# EasyEDA Pro project ProDocument_PCB2.epro

# Schematic Schematic2
Create Date: 2023-10-05; Page Name: P1; Project Name: 步进电机驱动板; Schematic Name: Schematic2; Update Date: 2024-01-28; Company: 嘉立创EDA; Page Size: A4; Version: V1.0
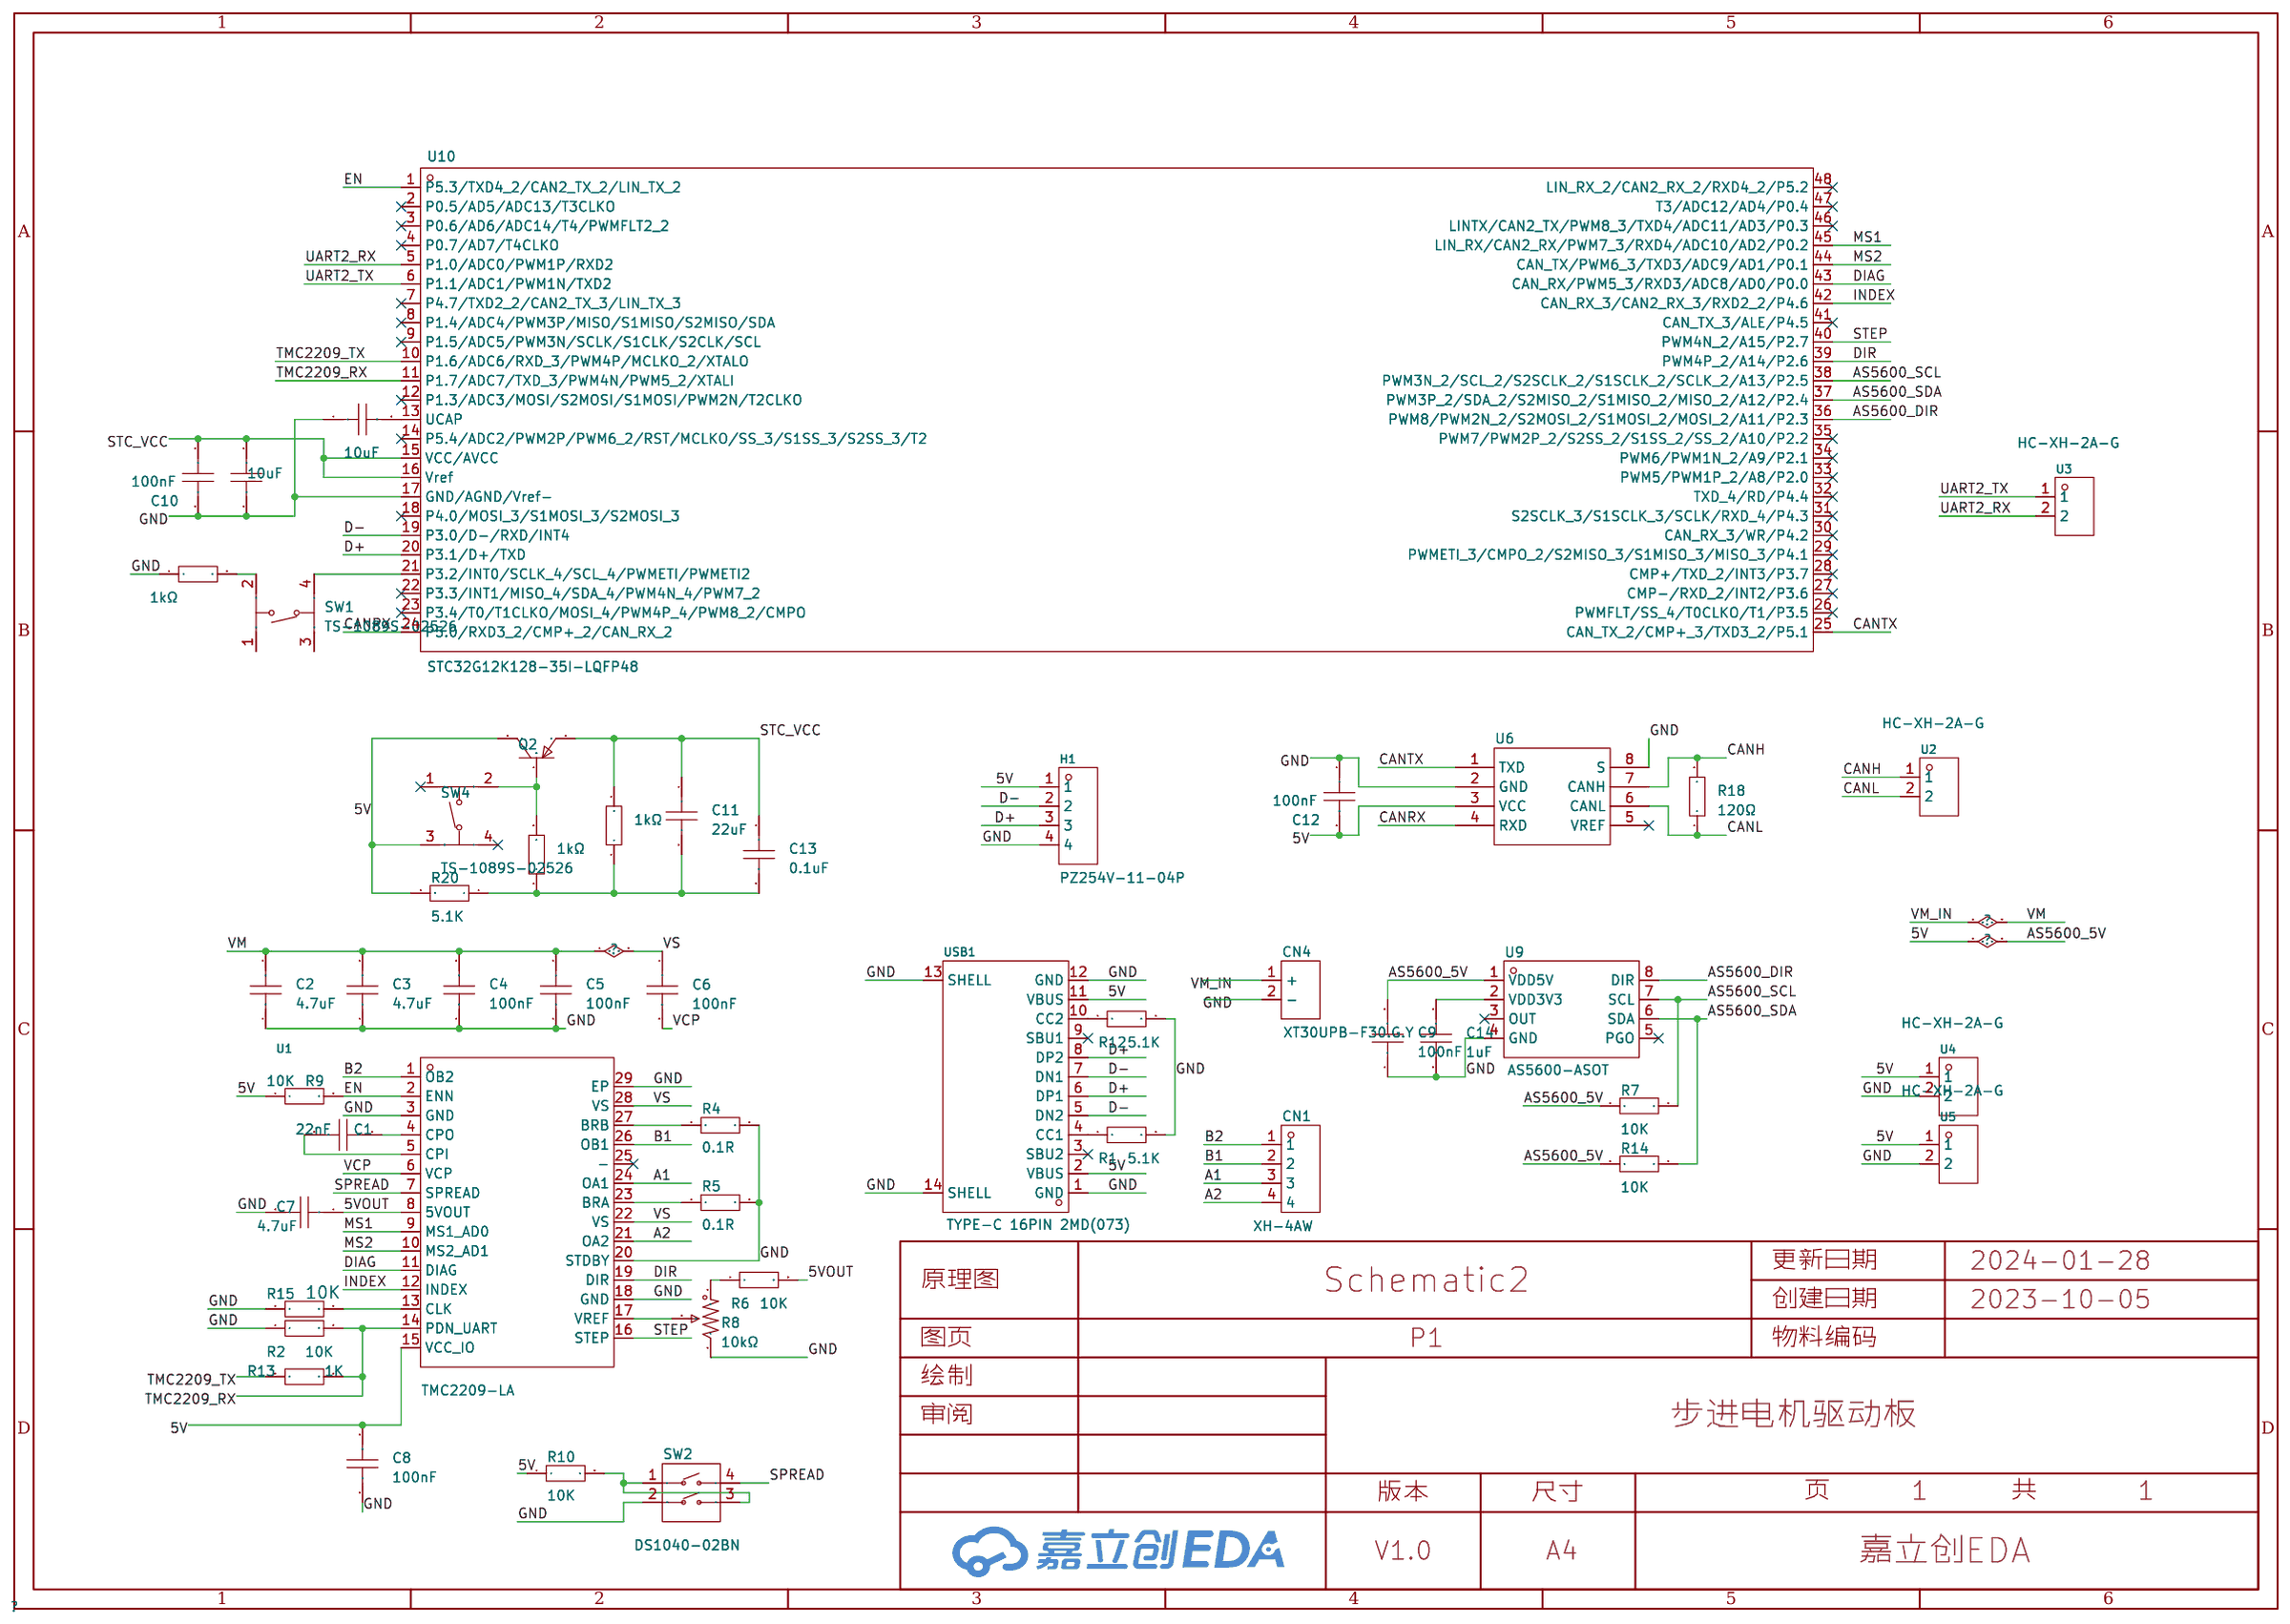
[diagram p0: schematic sheet]

## Parts
C1  22nF  [C0603]
C2  4.7uF  [C0603]
C3  4.7uF  [C0603]
C4  100nF  [C0603]
C5  100nF  [C0603]
C6  100nF  [C0603]
C7  4.7uF  [C0603]
C8  100nF  [C0603]
C9  100nF  [C0603]
C10  100nF  [C0603]
C11  22uF  [C0603]
C12  100nF  [C0603]
C13  0.1uF  [C0603]
C14  1uF  [C0805]
C15  10uF  [C0603]
C71  10uF  [C0603]
CN1  XH-4AW  [CONN-TH_XH-4AW]
CN4  XT30UPB-F30.G.Y  [CONN-TH_XT30UPB-F]
H1  PZ254V-11-04P  [HDR-TH_4P-P2.54-V-M]
Q2  S8550  [SOT-23-3_L2.9-W1.3-P1.90-LS2.4-BR]
R1  5.1K  [R0603]
R2  10K  [R0603]
R4  0.1R  [R1206]
R5  0.1R  [R1206]
R6  10K  [R0603]
R7  10K  [R0603]
R8  10kΩ  [RES-ADJ-SMD_3P-L3.0-W3.8-P1.75-BR]
R9  10K  [R0603]
R10  10K  [R0603]
R12  5.1K  [R0603]
R13  1K  [R0603]
R14  10K  [R0603]
R15  10K  [R0603]
R17  1kΩ  [R0603]
R18  120Ω  [R0603]
R19  1kΩ  [R0603]
R20  5.1K  [R0603]
R48  1kΩ  [R0603]
SW1  TS-1089S-02526  [SW-SMD_4P-L4.2-W3.3-P2.15-LS5.1]
SW2  DS1040-02BN  [KEY-TH_DS1040-02BN]
SW4  TS-1089S-02526  [SW-SMD_4P-L4.2-W3.3-P2.15-LS5.1]
U1  TMC2209-LA  [QFN-28_L5.0-W5.0-P0.50-BL-EP]
U2  HC-XH-2A-G  [CONN-TH_2P-P2.50_HC-XH-2A-G]
U3  HC-XH-2A-G  [CONN-TH_2P-P2.50_HC-XH-2A-G]
U4  HC-XH-2A-G  [CONN-TH_2P-P2.50_HC-XH-2A-G]
U5  HC-XH-2A-G  [CONN-TH_2P-P2.50_HC-XH-2A-G]
U6  TJA1050T/CM,118  [SOIC-8_L5.0-W4.0-P1.27-LS6.0-BL]
U9  AS5600-ASOT  [SOIC-8_L5.0-W4.0-P1.27-LS6.0-BL]
U10  STC32G12K128-35I-LQFP48  [LQFP-48_L7.0-W7.0-P0.50-LS9.0-BL]
USB1  TYPE-C 16PIN 2MD(073)  [USB-C-SMD_TYPE-C-6PIN-2MD-073]

## Library data of the parts
C1-C14 = CAP_0603: Supplier Footprint: 0603
C15 C71 = CL10A106MA8NRNC: 容值:10uF;精度:±20%;额定电压:25V;材质(温度系数):X5R;; LCSC Part Name: 10uF ±20% 25V; Supplier Part: C96446; Manufacturer: SAMSUNG(三星); Supplier Footprint: 0603; JLCPCB Part Class: Basic Part; Datasheet: https://atta.szlcsc.com/upload/public/pdf/source/20170325/1490427913016.pdf; Supplier: LCSC; Tolerance: ±20%; Voltage Rated: 25V; Temperature Coefficient: X5R
CN1 = XH-4AW: 参考系列:XH;间距:2.54mm;插针结构:1x4P;排数:1;每排PIN数:4;行距:-;公母:公型插针;安装方式:弯插;额定电流:3A;工作温度范围:-25℃~+85℃;; LCSC Part Name: XH 2.54mm 1x4P 弯插; Supplier Part: C2908613; Manufacturer: HCTL(华灿天禄); Supplier Footprint: 插件,P=2.54mm; JLCPCB Part Class: Extended Part; Datasheet: https://atta.szlcsc.com/upload/public/pdf/source/20211021/ACA2D54D99493880102FCACAC8DAABA8.pdf; Supplier: LCSC; Reference Series: XH; Pitch: 2.54mm; Pins Structure: 1x4P; Number of Rows: 1; Number of PINs Per Row: 4; Gender: 公型插针; Mounting Style: 弯插; Current Rating (Max): 3A; Operating Temperature Range: -25℃~+85℃
CN4 = XT30UPB-F30.G.Y: 类别:-;类型1:-;; LCSC Part Name: AMASS(艾迈斯)直立焊板式连接器XT30UPB30-F.G.*; Supplier Part: C108769; Manufacturer: AMASS(艾迈斯); JLCPCB Part Class: Extended Part; Datasheet: https://atta.szlcsc.com/upload/public/pdf/source/20220715/AFD68B9E8B6CA95A7295DBF4AF9325E4.pdf; Supplier: LCSC; Brand: 艾迈斯; Type: 航模插头; Colour: 黄色; RatedVoltage: DC 500V; InterfaceType: 母头; MetalMaterial: 镀金; InsulationMaterial: PA; RatedCurrent: 15A; contact resistance: 0.65mΩ
H1 = PZ254V-11-04P: 排数:单排;总PIN位数:4P;间距:2.54mm;插针结构:1x4P;行距:-;安装类型:直插;圆针/方针:方针;额定电流:3A;额定电压:250V;配合针长度:6mm;塑高:2.5mm;端接针长度:3mm;触头材质:-;工作温度范围:-40℃~+105℃;颜色:黑色;; LCSC Part Name: 2.54mm 1x4P 直插 方针; Supplier Part: C2691448; Manufacturer: XFCN(兴飞); Supplier Footprint: 插件,P=2.54mm; JLCPCB Part Class: Extended Part; Datasheet: https://atta.szlcsc.com/upload/public/pdf/source/20200309/C492403_F9F19131791D08044AD4F84F8E751A34.pdf; Supplier: LCSC; Number of Rows: 单排; Number of Pins: 4P; Pitch: 2.54mm; Pin Structure: 1x4P; Mounting Type: 直插; Circluar Pins/Square Pins: 方针; Current Rating (Max): 3A; Voltage Rating (Max): 250V; Length of Mating Pin: 6mm; Insulation Height: 2.5mm; Length of End Connection Pin: 3mm; Operating Temperature Range: -40℃~+105℃; Color: 黑色
Q2 = S8550_C2891805: Supplier Part: C2891805; Manufacturer: YONGYUTAI(永裕泰); Supplier Footprint: SOT-23; JLCPCB Part Class: Extended Part; Datasheet: https://atta.szlcsc.com/upload/public/pdf/source/20210901/65C3C4D1695A9271DEFEFE0B623CB3B1.pdf; Supplier: LCSC
R1 R2 R5-R7 R9 R10 R12-R15 R20 = Res_0603: Supplier Footprint: 0603
R4 = Res_0603: Supplier Footprint: 1206
R8 = TC33X-2-103E: 阻值:10kΩ;精度:±25%;功率:150mW;圈数:-;额定电压:-;; LCSC Part Name: 10kΩ ±25%; Supplier Part: C719176; Manufacturer: BOURNS; Supplier Footprint: SMD; JLCPCB Part Class: 扩展库; Datasheet: https://atta.szlcsc.com/upload/public/pdf/source/20200810/C720646_BB66A75E654D5E1D30127FF45BCD3C26.pdf; Supplier: LCSC; Tolerance: ±25%; Power(Watts): 150mW
R17 R19 R48 = 0603WAF1001T5E: 电阻类型:厚膜电阻;阻值:1kΩ;精度:±1%;功率:100mW;温度系数:±100ppm/;最大工作电压:75V;工作温度范围:-55~+155;; LCSC Part Name: 1kΩ ±1% 100mW; Supplier Part: C21190; Manufacturer: UNI-ROYAL(厚声); Supplier Footprint: 0603; JLCPCB Part Class: Basic Part; Datasheet: https://atta.szlcsc.com/upload/public/pdf/source/20200306/C422600_1E6D84923E4A46A82E41ADD87F860B5C.pdf; Supplier: LCSC; Type: 厚膜电阻; Tolerance: ±1%; Power(Watts): 100mW; Temperature Coefficient: ±100ppm/; Overload Voltage (Max): 75V; Operating Temperature Range: -55~+155
R18 = 0603WAF1200T5E: 电阻类型:厚膜电阻;阻值:120Ω;精度:±1%;功率:100mW;; LCSC Part Name: 120Ω ±1% 100mW; Supplier Part: C22787; Manufacturer: UNI-ROYAL(厚声); Supplier Footprint: 0603; JLCPCB Part Class: Basic Part; Datasheet: https://atta.szlcsc.com/upload/public/pdf/source/20200306/C422600_1E6D84923E4A46A82E41ADD87F860B5C.pdf; Supplier: LCSC; Type: 厚膜电阻; Tolerance: ±1%; Power(Watts): 100mW; Temperature Coefficient: ±100ppm/℃; Overload Voltage (Max): 75V; Operating Temperature Range: -55℃~+155℃
SW1 SW4 = TS-1089S-02526: 触点电流:50mA;额定电压(DC):12V;电路结构:单刀单掷;安装方式:立贴;带灯:-;机械寿命:-;; LCSC Part Name: 4.2*3.25*2.5mm 立贴 轻触开关; Supplier Part: C455282; Manufacturer: XUNPU(讯普); Supplier Footprint: SMD,3.3x4.2mm; JLCPCB Part Class: Extended Part; Datasheet: https://atta.szlcsc.com/upload/public/pdf/source/20191118/C455282_2E86A26A9CC4FEF4662951C4D45ED672.pdf; Supplier: LCSC; Contact Current: 50mA; Voltage Rating (DC): 12V; Circuit: 单刀单掷; Mounting Style: 立贴; Actuator Style: 椭圆形按钮; Switch Length: 4.2mm; Switch Width: 3.25mm; Switch Height: 2.5mm
SW2 = DS1040-02BN: 拨码开关，平拔，2P，蓝色，镀金; Supplier Part: C3040968; Manufacturer: CONNFLY; Supplier Footprint: 插件; JLCPCB Part Class: Extended Part; Datasheet: https://atta.szlcsc.com/upload/public/pdf/source/20220524/E487E22DEF95345BB2C3C9897C5E0C2D.pdf; Supplier: LCSC
U1 = TMC2209-LA: Supplier Part: C465949; Manufacturer: TRINAMIC; Supplier Footprint: QFN-28-EP(5x5); JLCPCB Part Class: Extended Part; Datasheet: https://atta.szlcsc.com/upload/public/pdf/source/20191203/C465949_E563A3313F5F3F9C62E6E946672F7886.pdf; Supplier: LCSC
U2-U5 = HC-XH-2A-G: 参考系列:XH;间距:2.54mm;插针结构:1x2P;排数:1;每排PIN数:2;行距:2.54mm;公母:公型插针;安装方式:直插;额定电流:3A;工作温度范围:-25℃~+85℃;; LCSC Part Name: XH 2.54mm 1x2P 直插; Supplier Part: C5341201; Manufacturer: HCTL(华灿天禄); Supplier Footprint: 插件,P=2.5mm; JLCPCB Part Class: Extended Part; Datasheet: https://atta.szlcsc.com/upload/public/pdf/source/20230105/4FFD2EFD3DA44AA828171A44400F3EDE.pdf; Supplier: LCSC; Reference Series: XH; Pitch: 2.54mm; Pins Structure: 1x2P; Number of Rows: 1; Number of PINs Per Row: 2; Row Spacing: 2.54mm; Gender: 公型插针; Mounting Style: 直插; Current Rating (Max): 3A; Operating Temperature Range: -25℃~+85℃
U6 = TJA1050T/CM,118: 类型:收发器;电源电压(Vcc):4.75V~5.25V;; Supplier Part: C6952; Manufacturer: NXP(恩智浦); Supplier Footprint: SOIC-8-150mil; JLCPCB Part Class: Basic Part; Datasheet: https://atta.szlcsc.com/upload/public/pdf/source/20140411/1457707042917.pdf; Supplier: LCSC; Type: 收发器; Supply Voltage: 4.75V~5.25V
U9 = AS5600-ASOT: Supplier Part: C499458; Manufacturer: ams(艾迈斯半导体); Supplier Footprint: SOIC-8; JLCPCB Part Class: Extended Part; Datasheet: https://atta.szlcsc.com/upload/public/pdf/source/20200324/C499458_E1461AFB0CE1042DE5756821C534625C.pdf; Supplier: LCSC
U10 = STC32G12K128-35I-LQFP48: Supplier Part: C5210760; Manufacturer: STC(宏晶); Supplier Footprint: LQFP-48; JLCPCB Part Class: Extended Part; Datasheet: https://atta.szlcsc.com/upload/public/pdf/source/20221024/7E1DE984F38A86C33FBCAE5F73F916E7.pdf; Supplier: LCSC
USB1 = TYPE-C 16PIN 2MD(073): 连接器类型:Type-C;标准:-;公母:母座;触点数量:16;端口数量:1;安装方式:卧贴;额定电流 - 电源:5A;工作温度范围:-25℃~+85℃;; LCSC Part Name: TYPE-C母座 16P 4脚插件带定位柱 不锈钢外壳 2次模顶; Supplier Part: C2765186; Manufacturer: SHOU HAN(首韩); Supplier Footprint: SMD; JLCPCB Part Class: Extended Part; Supplier: LCSC; Connector Type: Type-C; Gender: 母座; Number of Contacts: 16; Number of Ports: 1; Mounting Style: 卧贴; Current Rating - Power (Max): 5A; Operating Temperature Range: -25℃~+85℃

## Nets
5V: C8.2 C9.2 C12.2 H1.1 Q2.3(C) R7.2 R9.1 R10.1 R14.2 R20.2 SW4.3 U1.15(VCC_IO) U4.1 U5.1 U6.3(VCC) U9.1(VDD5V) USB1.2(VBUS) USB1.11(VBUS)
5VOUT: C7.1 R6.2 U1.8(5VOUT)
GND: C2.1 C3.1 C4.1 C5.1 C7.2 C8.1 C9.1 C10.2 C12.1 C14.2 C15.1 C71.2 CN4.2(-) H1.4 R1.2 R2.1 R4.2 R5.2 R8.3 R12.2 R15.1 R48.1 SW2.2 U1.3(GND) U1.18(GND) U1.20(STDBY) U1.29(EP) U4.2 U5.2 U6.2(GND) U6.8(S) U9.4(GND) U10.17(GND/AGND/Vref-) USB1.1(GND) USB1.12(GND) USB1.13(SHELL) USB1.14(SHELL)
A1: CN1.3 U1.24(OA1)
A2: CN1.4 U1.21(OA2)
AS5600_DIR: U9.8(DIR) U10.36(PWM8/PWM2N_2/S2MOSI_2/S1MOSI_2/MOSI_2/A11/P2.3)
AS5600_SCL: R7.1 U9.7(SCL) U10.38(PWM3N_2/SCL_2/S2SCLK_2/S1SCLK_2/SCLK_2/A13/P2.5)
AS5600_SDA: R14.1 U9.6(SDA) U10.37(PWM3P_2/SDA_2/S2MISO_2/S1MISO_2/MISO_2/A12/P2.4)
B1: CN1.2 U1.26(OB1)
B2: CN1.1 U1.1(OB2)
CANH: R18.2 U2.1 U6.7(CANH)
CANL: R18.1 U2.2 U6.6(CANL)
CANRX: U6.4(RXD) U10.24(P5.0/RXD3_2/CMP+_2/CAN_RX_2)
CANTX: U6.1(TXD) U10.25(CAN_TX_2/CMP+_3/TXD3_2/P5.1)
D+: H1.3 U10.20(P3.1/D+/TXD) USB1.6(DP1) USB1.8(DP2)
D-: H1.2 U10.19(P3.0/D-/RXD/INT4) USB1.5(DN2) USB1.7(DN1)
DIAG: U1.11(DIAG) U10.43(CAN_RX/PWM5_3/RXD3/ADC8/AD0/P0.0)
DIR: U1.19(DIR) U10.39(PWM4P_2/A14/P2.6)
EN: R9.2 U1.2(ENN) U10.1(P5.3/TXD4_2/CAN2_TX_2/LIN_TX_2)
INDEX: U1.12(INDEX) U10.42(CAN_RX_3/CAN2_RX_3/RXD2_2/P4.6)
MS1: U1.9(MS1_AD0) U10.45(LIN_RX/CAN2_RX/PWM7_3/RXD4/ADC10/AD2/P0.2)
MS2: U1.10(MS2_AD1) U10.44(CAN_TX/PWM6_3/TXD3/ADC9/AD1/P0.1)
SPREAD: SW2.4 U1.7(SPREAD)
STC_VCC: C10.1 C11.1 C13.1 C71.1 Q2.2(E) R17.2 U10.15(VCC/AVCC) U10.16(Vref)
STEP: U1.16(STEP) U10.40(PWM4N_2/A15/P2.7)
TMC2209_RX: R2.2 R13.1 U1.14(PDN_UART) U10.11(P1.7/ADC7/TXD_3/PWM4N/PWM5_2/XTALI)
TMC2209_TX: R13.2 U10.10(P1.6/ADC6/RXD_3/PWM4P/MCLKO_2/XTALO)
UART2_RX: U3.2 U10.5(P1.0/ADC0/PWM1P/RXD2)
UART2_TX: U3.1 U10.6(P1.1/ADC1/PWM1N/TXD2)
VCP: C6.2 U1.6(VCP)
VM: C2.2 C3.2 C4.2 C5.2 C6.1 CN4.1(+) U1.22(VS) U1.28(VS)
Net-(C1-1): C1.1 U1.4(CPO)
Net-(C1-2): C1.2 U1.5(CPI)
Net-(C11-2): C11.2 C13.2 R17.1 R19.1 R20.1
Net-(C14-1): C14.1 U9.2(VDD3V3)
Net-(C15-2): C15.2 U10.13(UCAP)
Net-(Q2-1): Q2.1(B) R19.2 SW4.2
Net-(R1-1): R1.1 USB1.4(CC1)
Net-(R4-1): R4.1 U1.27(BRB)
Net-(R5-1): R5.1 U1.23(BRA)
Net-(R6-1): R6.1 R8.1
Net-(R8-2): R8.2 U1.17(VREF)
Net-(R10-2): R10.2 SW2.1 SW2.3
Net-(R12-1): R12.1 USB1.10(CC2)
Net-(R15-2): R15.2 U1.13(CLK)
Net-(R48-2): R48.2 SW1.2
Net-(SW1-4): SW1.4 U10.21(P3.2/INT0/SCLK_4/SCL_4/PWMETI/PWMETI2)

Not connected (* = marked no-connect by the designer): SW1 1 3; SW4 1* 4*; U1 25(-)*; U6 5(VREF)*; U9 3(OUT)* 5(PGO)*; U10 2(P0.5/AD5/ADC13/T3CLKO)* 3(P0.6/AD6/ADC14/T4/PWMFLT2_2)* 4(P0.7/AD7/T4CLKO)* 7(P4.7/TXD2_2/CAN2_TX_3/LIN_TX_3)* 8(P1.4/ADC4/PWM3P/MISO/S1MISO/S2MISO/SDA)* 9(P1.5/ADC5/PWM3N/SCLK/S1CLK/S2CLK/SCL)* 12(P1.3/ADC3/MOSI/S2MOSI/S1MOSI/PWM2N/T2CLKO)* 14(P5.4/ADC2/PWM2P/PWM6_2/RST/MCLKO/SS_3/S1SS_3/S2SS_3/T2)* 18(P4.0/MOSI_3/S1MOSI_3/S2MOSI_3)* 22(P3.3/INT1/MISO_4/SDA_4/PWM4N_4/PWM7_2)* 23(P3.4/T0/T1CLKO/MOSI_4/PWM4P_4/PWM8_2/CMPO)* 26(PWMFLT/SS_4/T0CLKO/T1/P3.5)* 27(CMP-/RXD_2/INT2/P3.6)* 28(CMP+/TXD_2/INT3/P3.7)* 29(PWMETI_3/CMPO_2/S2MISO_3/S1MISO_3/MISO_3/P4.1)* 30(CAN_RX_3/WR/P4.2)* 31(S2SCLK_3/S1SCLK_3/SCLK/RXD_4/P4.3)* 32(TXD_4/RD/P4.4)* 33(PWM5/PWM1P_2/A8/P2.0)* 34(PWM6/PWM1N_2/A9/P2.1)* 35(PWM7/PWM2P_2/S2SS_2/S1SS_2/SS_2/A10/P2.2)* 41(CAN_TX_3/ALE/P4.5)* 46(LINTX/CAN2_TX/PWM8_3/TXD4/ADC11/AD3/P0.3)* 47(T3/ADC12/AD4/P0.4)* 48(LIN_RX_2/CAN2_RX_2/RXD4_2/P5.2)*; USB1 3(SBU2)* 9(SBU1)*
